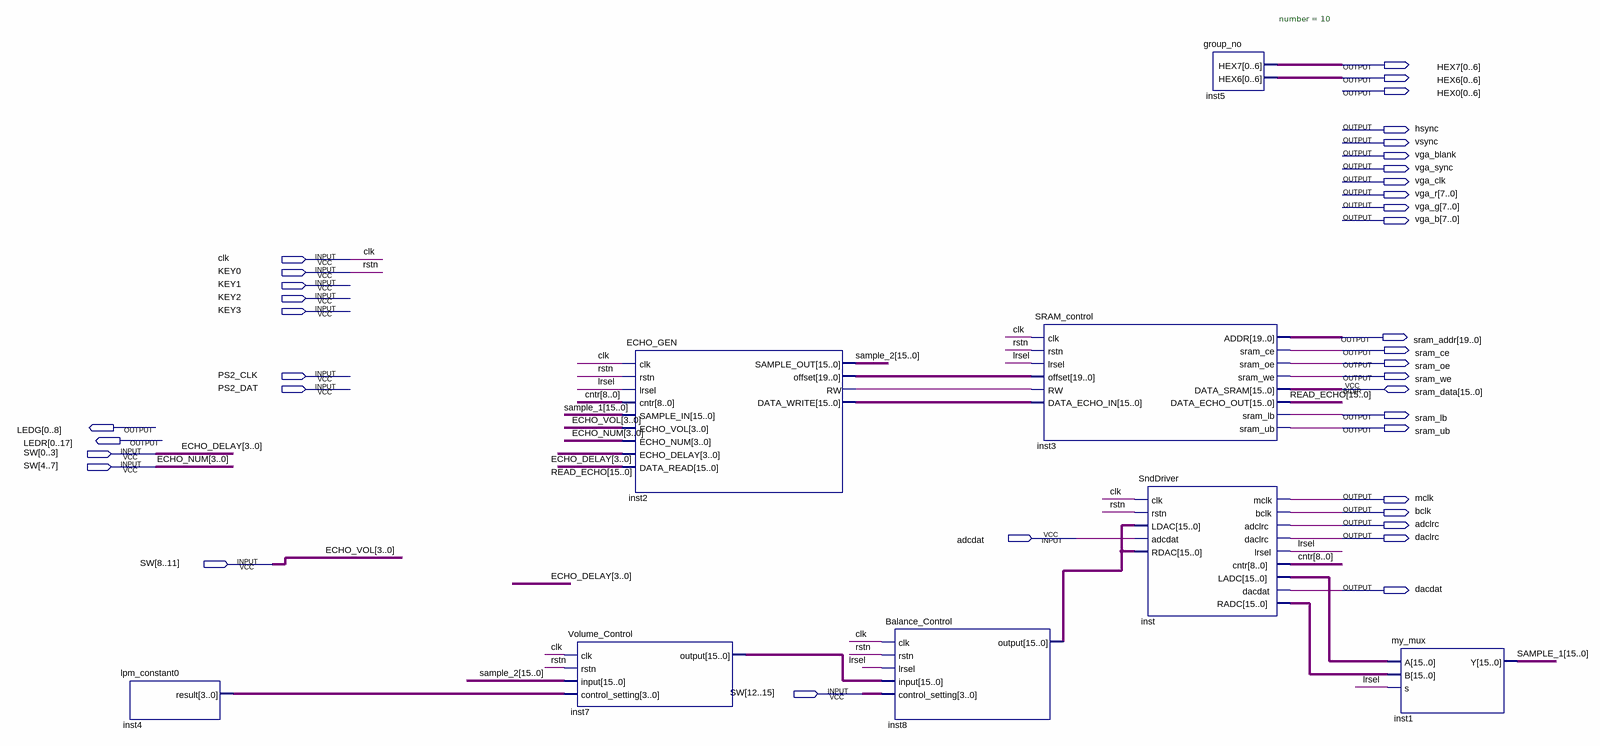
[diagram p0: schematic sheet]
// Quartus schematic Proj.bdf as structural Verilog: 8 symbols, 37 pins
module Proj (
  input  clk,
  input  KEY0,
  input  KEY1,
  input  KEY2,
  input  KEY3,
  input  PS2_CLK,
  input  PS2_DAT,
  input  [0:15] SW,
  input  adcdat,
  inout  [15:0] sram_data,
  output [0:6] HEX7,
  output [0:6] HEX6,
  output [0:6] HEX0,
  output hsync,
  output vsync,
  output vga_blank,
  output vga_sync,
  output vga_clk,
  output [7:0] vga_r,
  output [7:0] vga_g,
  output [7:0] vga_b,
  output [19:0] sram_addr,
  output sram_ce,
  output sram_oe,
  output sram_we,
  output sram_lb,
  output [0:8] LEDG,
  output sram_ub,
  output [0:17] LEDR,
  output mclk,
  output bclk,
  output adclrc,
  output daclrc,
  output dacdat
);

  wire inst2_rw, lrsel;
  wire [3:0] inst4_result;
  wire [8:0] cntr;
  wire [15:0] inst2_data_write, inst7_output, inst8_output, inst_ladc, inst_radc, READ_ECHO, SAMPLE_1,
       sample_2;
  wire [19:0] inst2_offset;

  lpm_constant0 inst4 (.result(inst4_result));
  Volume_Control inst7 (
    .clk(clk), .rstn(KEY0), .\input (sample_2), .control_setting(inst4_result), .\output (inst7_output));
  ECHO_GEN inst2 (
    .clk(clk), .rstn(KEY0), .lrsel(lrsel), .cntr(cntr), .SAMPLE_IN(SAMPLE_1), .ECHO_VOL(SW[8:11]),
    .ECHO_NUM(SW[4:7]), .ECHO_DELAY(SW[0:3]), .DATA_READ(READ_ECHO), .SAMPLE_OUT(sample_2),
    .offset(inst2_offset), .RW(inst2_rw), .DATA_WRITE(inst2_data_write));
  Balance_Control inst8 (
    .clk(clk), .rstn(KEY0), .lrsel(lrsel), .\input (inst7_output), .control_setting(SW[12:15]),
    .\output (inst8_output));
  SRAM_control inst3 (
    .clk(clk), .rstn(KEY0), .lrsel(lrsel), .offset(inst2_offset), .RW(inst2_rw),
    .DATA_ECHO_IN(inst2_data_write), .ADDR(sram_addr), .sram_ce(sram_ce), .sram_oe(sram_oe),
    .sram_we(sram_we), .DATA_ECHO_OUT(READ_ECHO), .sram_lb(sram_lb), .sram_ub(sram_ub), .DATA_SRAM(sram_data));
  SndDriver inst (
    .clk(clk), .rstn(KEY0), .LDAC(inst8_output), .adcdat(adcdat), .RDAC(inst8_output), .mclk(mclk),
    .bclk(bclk), .adclrc(adclrc), .daclrc(daclrc), .lrsel(lrsel), .cntr(cntr), .LADC(inst_ladc),
    .dacdat(dacdat), .RADC(inst_radc));
  group_no #(.number(10)) inst5 (.HEX7(HEX7), .HEX6(HEX6));
  my_mux inst1 (.A(inst_ladc), .B(inst_radc), .s(lrsel), .Y(SAMPLE_1));

  // Other names for the same wires on the sheet: ECHO_DELAY[3:0] = SW[0:3]; ECHO_NUM[3:0] = SW[4:7];
  //   ECHO_VOL[3:0] = SW[8:11]; rstn = KEY0
endmodule
